# Altium schematic sheet 05_FPC_DB.SchDoc: FPC Connector
size 420 x 297 mm; Author: T. Ludemann; SheetNumber: 5; SheetTotal: 8; DocSize: DINA3
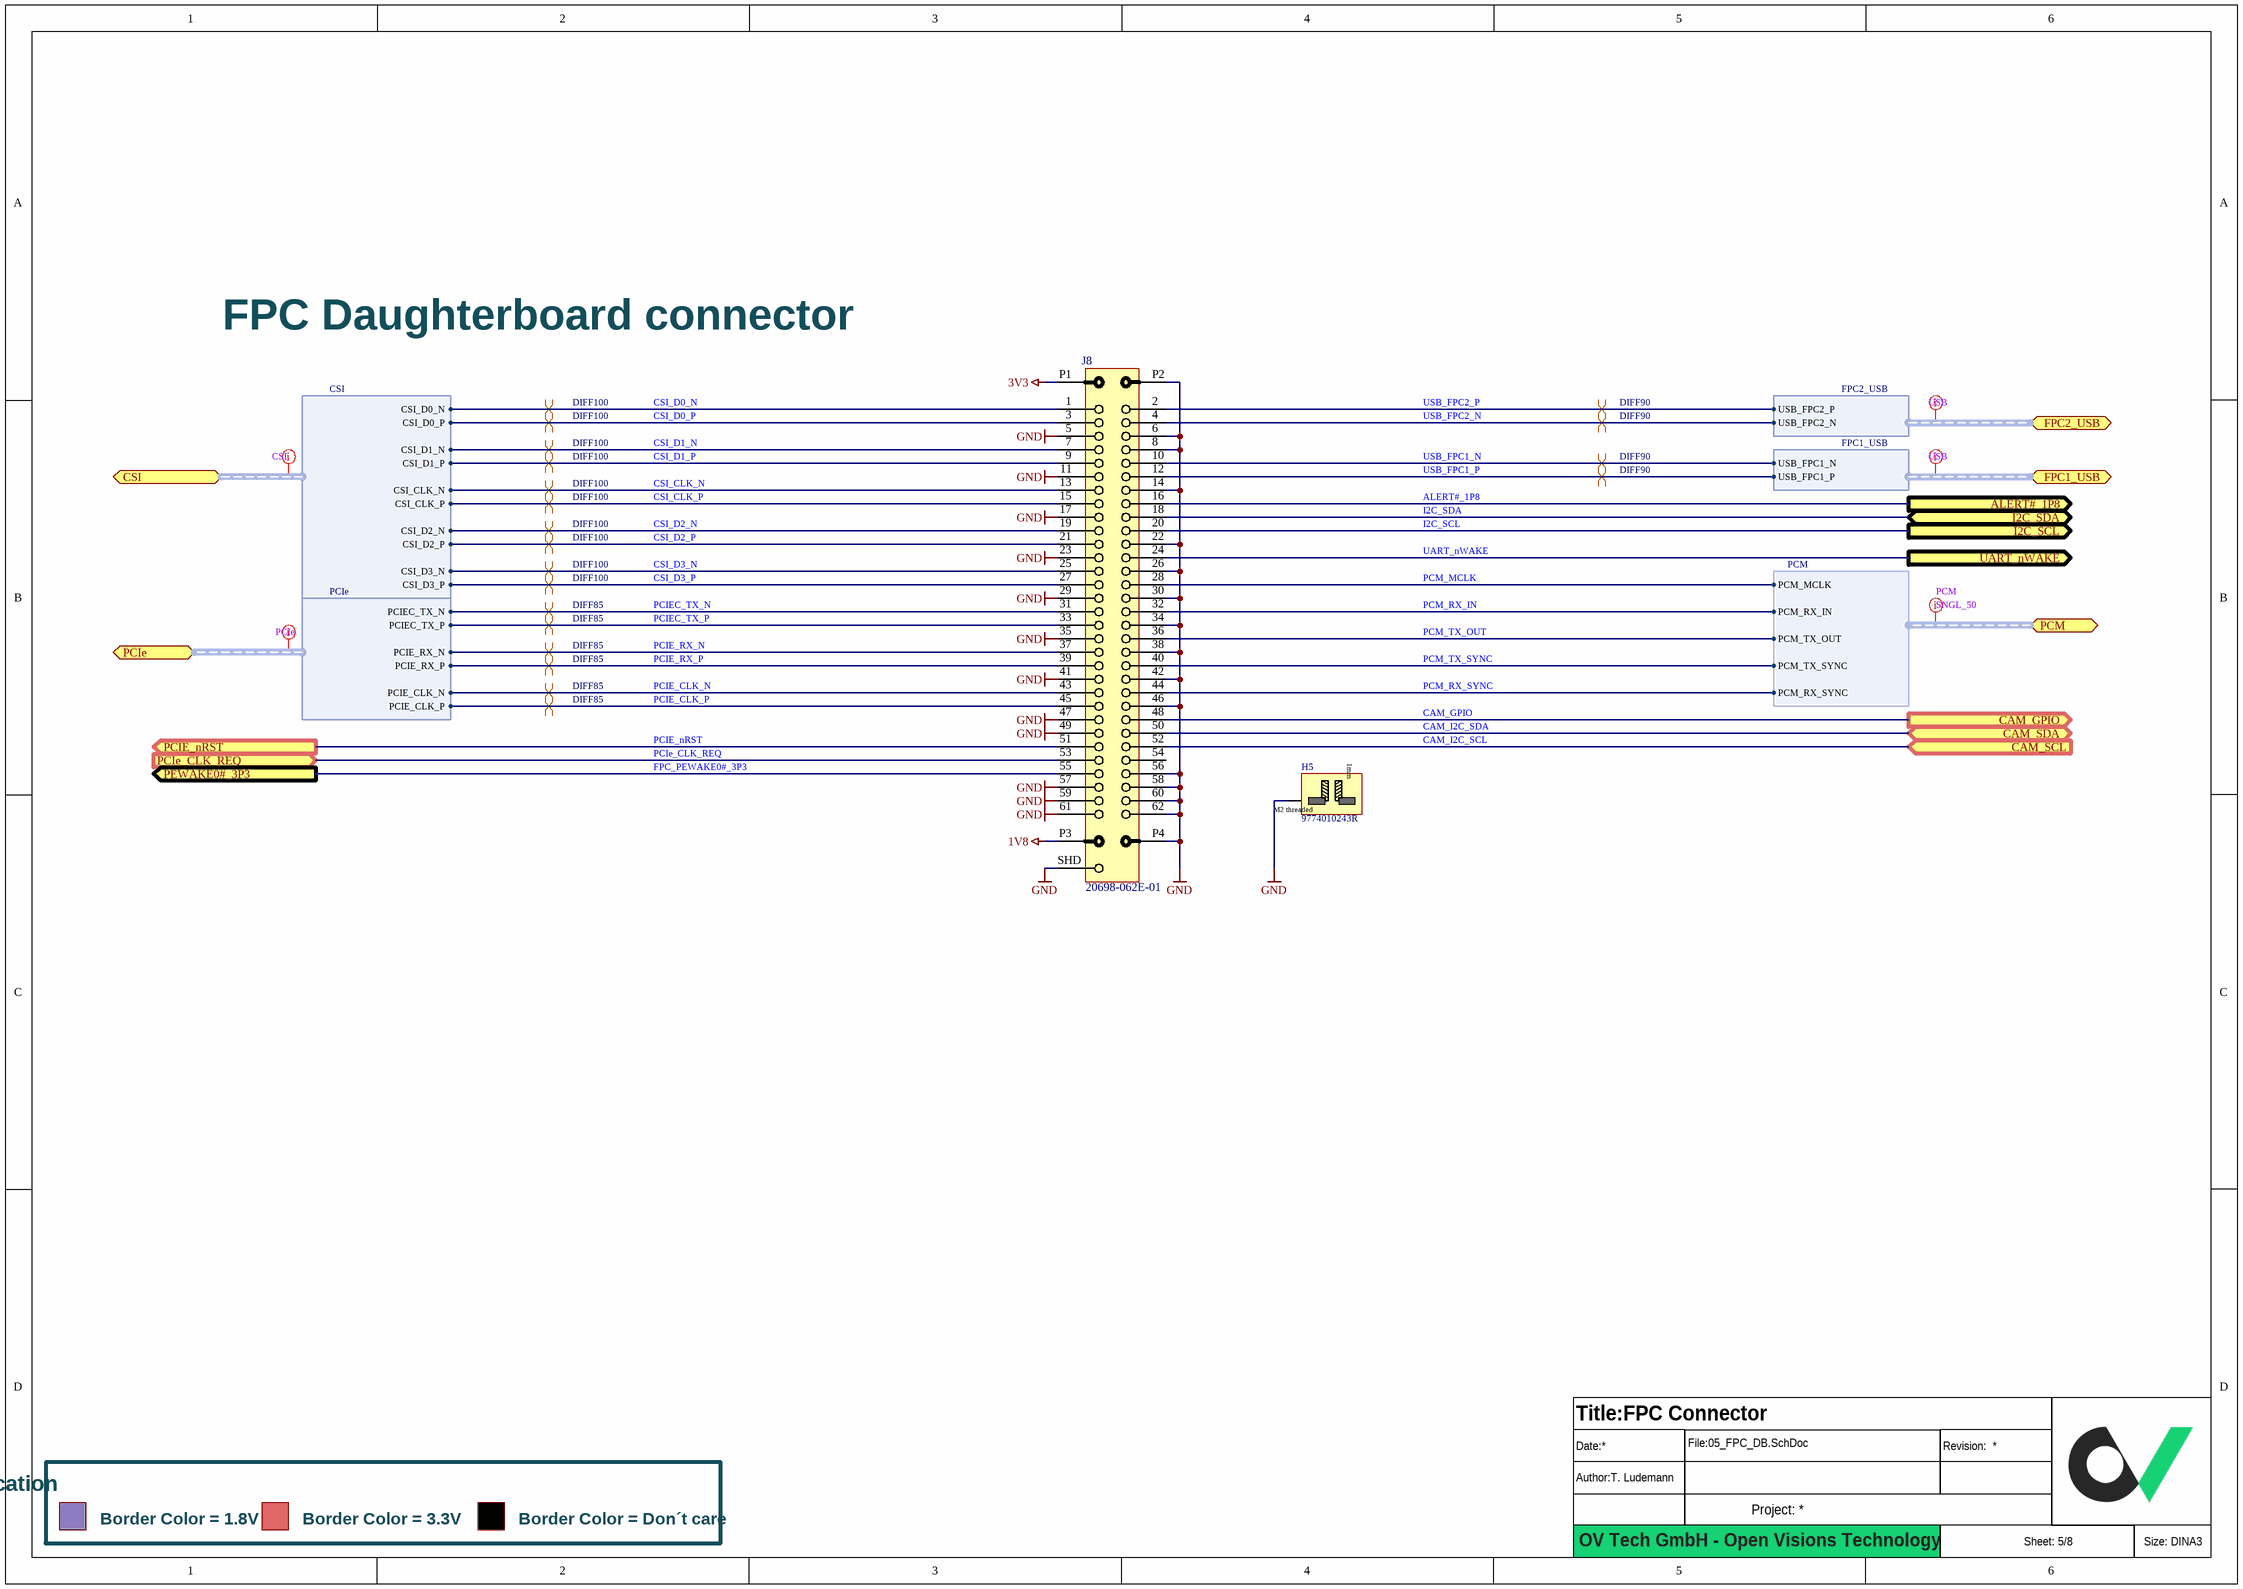
[diagram p0: 05_FPC_DB.SchDoc]

## Parts
?  (no value)  (graphical)
H5  9774010243R  [Spacer_SMD_M2x1_9774010243R]
J8  20698-062E-01  [BOARD-TO-BOARD 62POL_20698-062E-01]

## Ports
ALERT#_1P8 (out), CAM_GPIO (out), CAM_SCL (in), CAM_SDA (bidir), CSI (bidir, harness CSI), FPC1_USB (bidir, harness FPC1_USB), FPC2_USB (bidir, harness FPC2_USB), I2C_SCL (out), I2C_SDA (bidir), PCIe (bidir, harness PCIe), PCIe_CLK_REQ (in), PCIE_nRST (out), PCM (bidir, harness PCM), PEWAKE0#_3P3 (out), UART_nWAKE (out)

## Harnesses
CSI: CSI_D0_N, CSI_D0_P, CSI_D1_N, CSI_D1_P, CSI_CLK_N, CSI_CLK_P, CSI_D2_N, CSI_D2_P, CSI_D3_N, CSI_D3_P
PCIe: PCIE_CLK_N, PCIE_CLK_P, PCIEC_TX_N, PCIE_RX_P, PCIE_RX_N, PCIEC_TX_P
FPC1_USB: USB_FPC1_P, USB_FPC1_N
FPC2_USB: USB_FPC2_P, USB_FPC2_N
PCM: PCM_MCLK, PCM_TX_OUT, PCM_RX_IN, PCM_TX_SYNC, PCM_RX_SYNC

## Nets
1V8: J8.P3
3V3: J8.P1
GND: H5.MT J8.5 J8.6 J8.8 J8.11 J8.14 J8.17 J8.22 J8.23 J8.26 J8.29 J8.30 J8.34 J8.35 J8.38 J8.41 J8.42 J8.46 J8.47 J8.49 J8.56 J8.57 J8.58 J8.59 J8.60 J8.61 J8.62 J8.P2 J8.P4 J8.SHD
ALERT#_1P8: J8.16 ; port ALERT#_1P8
CAM_GPIO: J8.48 ; port CAM_GPIO
CAM_I2C_SCL: J8.52 ; port CAM_SCL
CAM_I2C_SDA: J8.50 ; port CAM_SDA
CSI_CLK_N: J8.13 ; port CSI.CSI_CLK_N
CSI_CLK_P: J8.15 ; port CSI.CSI_CLK_P
CSI_D0_N: J8.1 ; port CSI.CSI_D0_N
CSI_D0_P: J8.3 ; port CSI.CSI_D0_P
CSI_D1_N: J8.7 ; port CSI.CSI_D1_N
CSI_D1_P: J8.9 ; port CSI.CSI_D1_P
CSI_D2_N: J8.19 ; port CSI.CSI_D2_N
CSI_D2_P: J8.21 ; port CSI.CSI_D2_P
CSI_D3_N: J8.25 ; port CSI.CSI_D3_N
CSI_D3_P: J8.27 ; port CSI.CSI_D3_P
FPC_PEWAKE0#_3P3: J8.55 ; port PEWAKE0#_3P3
I2C_SCL: J8.20 ; port I2C_SCL
I2C_SDA: J8.18 ; port I2C_SDA
PCIE_CLK_N: J8.43 ; port PCIe.PCIE_CLK_N
PCIE_CLK_P: J8.45 ; port PCIe.PCIE_CLK_P
PCIe_CLK_REQ: J8.53 ; port PCIe_CLK_REQ
PCIE_nRST: J8.51 ; port PCIE_nRST
PCIE_RX_N: J8.37 ; port PCIe.PCIE_RX_N
PCIE_RX_P: J8.39 ; port PCIe.PCIE_RX_P
PCIEC_TX_N: J8.31 ; port PCIe.PCIEC_TX_N
PCIEC_TX_P: J8.33 ; port PCIe.PCIEC_TX_P
PCM_MCLK: J8.28 ; port PCM.PCM_MCLK
PCM_RX_IN: J8.32 ; port PCM.PCM_RX_IN
PCM_RX_SYNC: J8.44 ; port PCM.PCM_RX_SYNC
PCM_TX_OUT: J8.36 ; port PCM.PCM_TX_OUT
PCM_TX_SYNC: J8.40 ; port PCM.PCM_TX_SYNC
UART_nWAKE: J8.24 ; port UART_nWAKE
USB_FPC1_N: J8.10 ; port FPC1_USB.USB_FPC1_N
USB_FPC1_P: J8.12 ; port FPC1_USB.USB_FPC1_P
USB_FPC2_N: J8.4 ; port FPC2_USB.USB_FPC2_N
USB_FPC2_P: J8.2 ; port FPC2_USB.USB_FPC2_P

Not connected (* = marked no-connect by the designer): J8 54

## Layout directives
net class CSI: (no net found under the mark)
differential pair; differential pair class DIFF100: CSI_CLK_N, CSI_CLK_P, CSI_D0_N, CSI_D0_P, CSI_D1_N, CSI_D1_P, CSI_D2_N, CSI_D2_P, CSI_D3_N, CSI_D3_P
net class PCIe: (no net found under the mark)
differential pair; differential pair class DIFF85: PCIE_CLK_N, PCIE_CLK_P, PCIE_RX_N, PCIE_RX_P, PCIEC_TX_N, PCIEC_TX_P
net class USB: (no net found under the mark)
differential pair; differential pair class DIFF90: USB_FPC1_N, USB_FPC1_P, USB_FPC2_N, USB_FPC2_P
net class PCM; net class SNGL_50: (no net found under the mark)

## Notes on the sheet
- (near J8) FPC Daughterboard connector
- Signal Level Indication
- Border Color = 1.8V
- Border Color = 3.3V
- Border Color = Don´t care
- OV Tech GmbH - Open Visions Technology
- (in symbol Spacer_SMD_M2_internal_1mm) 1mm; M2 threaded

## Library data of the parts
? = Titleblock_01_OpenSource
H5 = Spacer_SMD_M2_internal_1mm: Würth Elektronik SMD Spacer M2 1mm length; Manufacturer 1: Würth Elektronik; Manufacturer 1 Prt. Nr.: 9774010243R
J8 = Board to Board Connector_62pol_20698-062E-01: Board to Board connector 62Pol FPC Header 0.35mm Pitch; Manufacturer 1: I-PEX; Manufacturer 1 Prt. Nr.: 20698-062E-01